# Altium schematic sheet pca20020_sheet5_motion_sensors.SchDoc: PCA20020 - Motion Sensors
size A4; DocumentNumber: 5; Revision: 1.0.0; SheetNumber: 5; SheetTotal: 9; DrawnBy: RUBR; PCAName: PCA20020; PCBRevision: 0264RUBR; DocumentSize: A4; PCBNumber: 400182
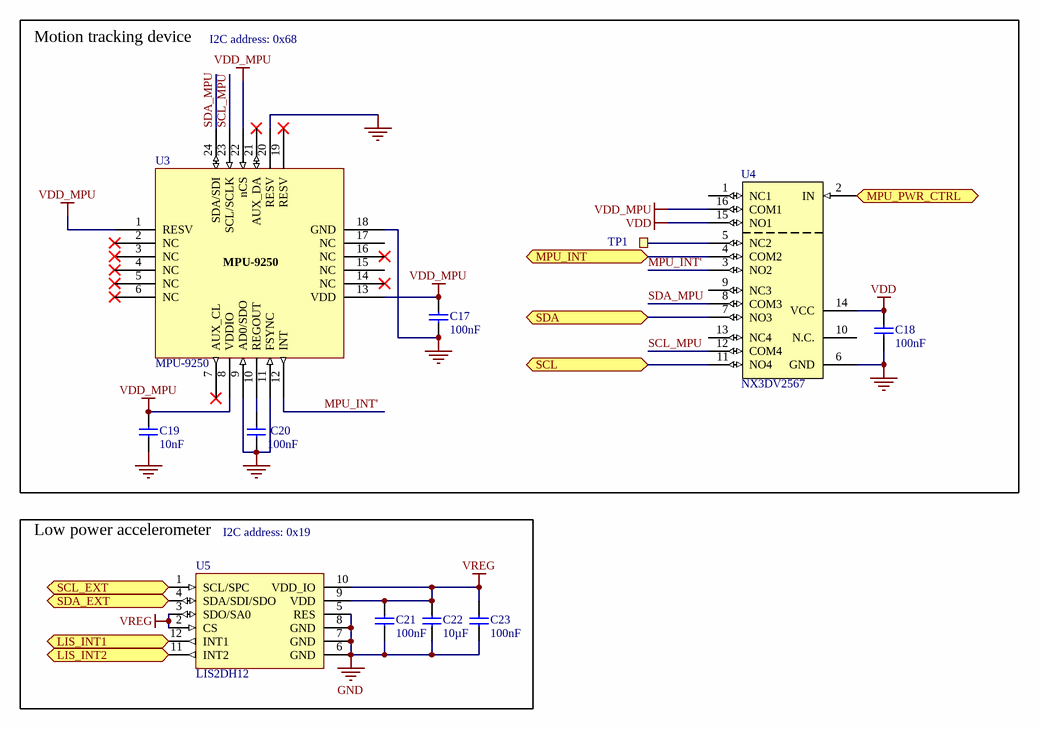
[diagram p0: pca20020_sheet5_motion_sensors.SchDoc]

## Parts
C17  100nF  [CAPC1005X04L]
C18  100nF  [CAPC1005X04L]
C19  10nF  [CAPC1005X04L]
C20  100nF  [CAPC1005X04L]
C21  100nF  [CAPC1005X04L]
C22  10µF  [CAPC1608X06L]
C23  100nF  [CAPC1005X04L]
TP1  TP  [TESTPAD-TH]  (value not drawn)  (no BOM)
U3  MPU-9250  [QFN40P300X300X105_HS-25N]
U4  NX3DV2567  [XQFN40P180X260X50-16N]
U5  LIS2DH12  [LGA50P200X200X100-12N]

## Blocks framed on the sheet
Motion tracking device: C17-C20 TP1 U3 U4
Low power accelerometer: C21-C23 U5

## Ports
LIS_INT1 (bidir), LIS_INT2 (bidir), MPU_INT (bidir), MPU_PWR_CTRL (bidir), SCL (bidir), SCL_EXT (bidir), SDA (bidir), SDA_EXT (bidir)

## Nets
GND: C17.1 C18.1 C19.1 C20.1 C21.1 C22.1 C23.1 U3.9(AD0/SDO) U3.11(FSYNC) U3.18(GND) U3.20(RESV) U4.6(GND) U5.5(RES) U5.6(GND) U5.7(GND) U5.8(GND)
VDD: C18.2 U4.14(VCC) U4.15(NO1)
VDD_MPU: C17.2 C19.2 U3.1(RESV) U3.8(VDDIO) U3.13(VDD) U3.22(nCS) U4.16(COM1)
VREG: C21.2 C22.2 C23.2 U5.2(CS) U5.3(SDO/SA0) U5.9(VDD) U5.10(VDD_IO)
LIS_INT1: U5.12(INT1) ; port LIS_INT1
LIS_INT2: U5.11(INT2) ; port LIS_INT2
MPU_INT: U4.4(COM2) ; port MPU_INT
MPU_INT': U3.12(INT) U4.3(NO2)
MPU_PWR_CTRL: U4.2(IN) ; port MPU_PWR_CTRL
SCL: U4.11(NO4) ; port SCL
SCL_EXT: U5.1(SCL/SPC) ; port SCL_EXT
SCL_MPU: U3.23(SCL/SCLK) U4.12(COM4)
SDA: U4.7(NO3) ; port SDA
SDA_EXT: U5.4(SDA/SDI/SDO) ; port SDA_EXT
SDA_MPU: U3.24(SDA/SDI) U4.8(COM3)
NetC20_2: C20.2 U3.10(REGOUT)
NetTP1_1: TP1.1 U4.5(NC2)

Not connected (* = marked no-connect by the designer): U3 2(NC)* 3(NC)* 4(NC)* 5(NC)* 6(NC)* 7(AUX_CL)* 14(NC)* 15(NC) 16(NC)* 17(NC) 19(RESV)* 21(AUX_DA)*; U4 1(NC1) 9(NC3) 10(N.C.) 13(NC4)

## Notes on the sheet
- I2C address: 0x68
- (near U5) I2C address: 0x19
- Title
- Size
- Date:
- Project Number
- Sheet         of
- Revision
- File:
- Drawn By:

## Library data of the parts
C17 C18 C20 C21 C23 = C0402-100n: Capacitor, X7R, ±10%; Part number IPS: 00000005296; Note: 16V; Artikkelnr Noca: 20039200; Artikkelnr Simpro: N.A.; Part Number: C0402-100n; Manufacturer: *; Manufacturer Part Number: *; Datasheet: *; LatestRevisionDate: 2009-11-23; Pin Count: 2; Publisher: Nordic Semiconductor; Published: 2009-05-08; Value: 100nF; Supplier: *; Supplier part number: *; 2nd source Supplier: *; 2nd source part number: *; Footprint Doc: 0402
C19 = C0402-10n: Capacitor, X7R, ±10%; Part number IPS: 00000007784; Note: 16V; Artikkelnr Noca: 20039166; Artikkelnr Simpro: N.A.; Part Number: C0402-10n; Manufacturer: *; Manufacturer Part Number: *; Datasheet: *; LatestRevisionDate: 2009-11-23; Pin Count: 2; Publisher: Nordic Semiconductor; Published: 2009-05-08; Value: 10nF; Supplier: *; Supplier part number: *; 2nd source Supplier: *; 2nd source part number: *; Footprint Doc: 0402
C22 = C0603-10µ: Capacitor, X5R, ±20%; Part number IPS: 00000007785; Note: 6.3V; Artikkelnr Noca: 20039234; Artikkelnr Simpro: N.A.; Part Number: C0603-10µ; Manufacturer: *; Manufacturer Part Number: *; Datasheet: *; Footprint Doc: 0603; LatestRevisionDate: 2011-01-17; Pin Count: 2; Publisher: Nordic Semiconductor; Published: 2011-01-17; Value: 10µF; Supplier: *; Supplier part number: *; 2nd source Supplier: *; 2nd source part number: *
TP1 = Testpoint TH: Testpoint, through hole; Artikkelnr Noca: N.A.; Part Number: Testpoint TH; Manufacturer: *; Manufacturer Part Number: *; Datasheet: *; Footprint Doc: TESTPAD-TH; LatestRevisionDate: 2009-12-12; Pin Count: 1; Publisher: Nordic Semiconductor; Published: 2009-12-12; Value: TP; Note: *; Supplier: *; Supplier part number: *; 2nd source Supplier: *; 2nd source part number: *; Artikkelnr Simpro: N.A.
U3 = MPU-9250: 9-axis MotionTracking™ Device; Manufacturer: InvenSense; Part number IPS: 00000007815; Note: 3-Axis Gyro, 3-Axis Accel and 3-Axis Compass; Artikkelnr Noca: N.A.; Part Number: MPU-9250; Manufacturer Part Number: MPU-9250; Datasheet: http://43zrtwysvxb2gf29r5o0athu.wpengine.netdna-cdn.com/wp-content/uploads/2015/02/MPU-9250-Datasheet.pdf; Footprint Doc: QFN-24; LatestRevisionDate: 2015-06-24; Pin Count: 24; Publisher: Nordic Semiconductor; Published: 2015-06-24; Value: MPU-9250; Supplier: Digi-Key; Supplier part number: 1428-1019-1-ND; 2nd source Supplier: *; 2nd source part number: *; Artikkelnr Simpro: N.A.
U4 = NX3DV2567GU: Low-ohmic four-pole double-throw analog switch; Manufacturer: NXP Semiconductors; 2nd source part number: 771-NX3DV2567GU115; Part number IPS: 00000007816; Artikkelnr Noca: 15079317; Artikkelnr Simpro: N.A.; Part Number: NX3DV2567GU; Manufacturer Part Number: NX3DV2567GU; Datasheet: http://www.nxp.com/documents/data_sheet/NX3DV2567.pdf; Footprint Doc: XQFN-16; LatestRevisionDate: 2015-02-17; Pin Count: 16; Publisher: Nordic Semiconductor; Published: 2015-02-17; Value: NX3DV2567; Note: *; Supplier: Digi-Key; Supplier part number: 568-5206-1-ND; 2nd source Supplier: Mouser
U5 = LIS2DH12: 3-axis - ±2g/±4g/±8g/±16g digital output femto accelerometer; Manufacturer: STMicroelectronics; 2nd source part number: 243-3081; Part number IPS: 00000007817; Note: MEMS digital output motion sensor ultra low-power high performance 3-axes "femto" accelerometer; Artikkelnr Noca: N.A.; Part Number: LIS2DH12; Manufacturer Part Number: LIS2DH12; Datasheet: http://www.st.com/st-web-ui/static/active/en/resource/technical/document/datasheet/DM00091513.pdf; Footprint Doc: LGA-12; LatestRevisionDate: 2015-09-29; Pin Count: 12; Publisher: Nordic Semiconductor; Published: 2015-09-29; Value: LIS2DH12; Supplier: Digi-Key; Supplier part number: 497-14851-1-ND; 2nd source Supplier: Farnell; Artikkelnr Simpro: N.A.